# Altium schematic sheet top.SchDoc: radFET Calibration Stand Card
size A4
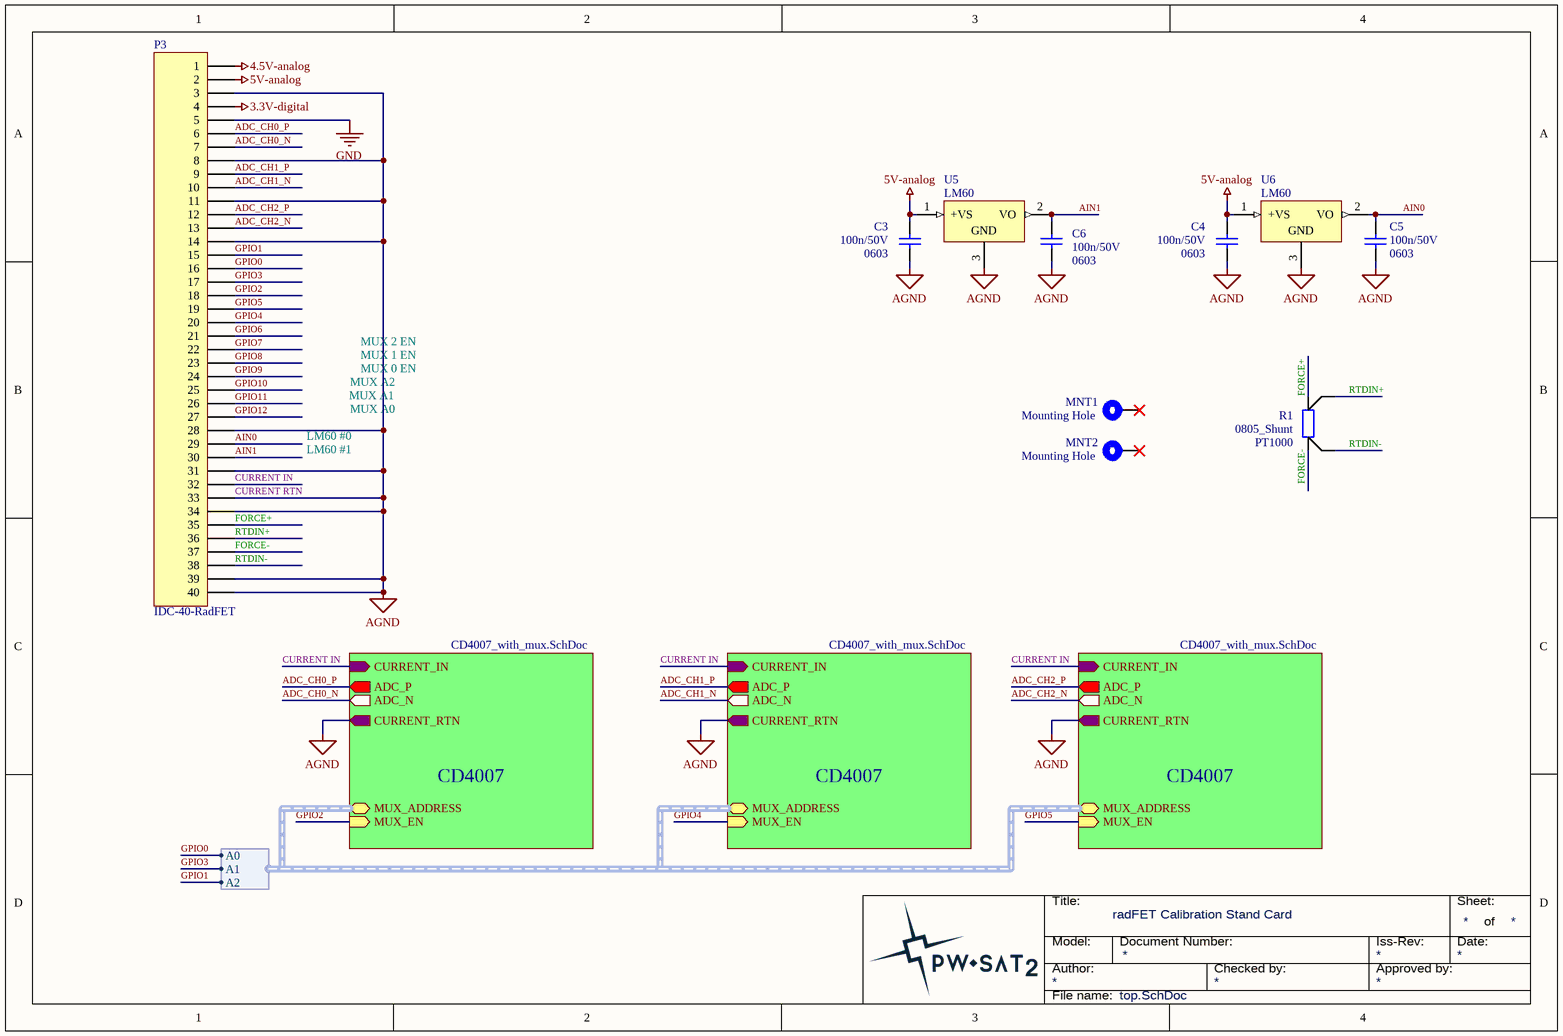
[diagram p0: top.SchDoc]

## Parts
C3  Package: 0603  [SMD_Capacitor_0603]  (hidden comment: 100n/50V)
C4  Package: 0603  [SMD_Capacitor_0603]  (hidden comment: 100n/50V)
C5  Package: 0603  [SMD_Capacitor_0603]  (hidden comment: 100n/50V)
C6  Package: 0603  [SMD_Capacitor_0603]  (hidden comment: 100n/50V)
MNT1  Mounting Hole  [PC-104_PcbMntHole_M3]
MNT2  Mounting Hole  [PC-104_PcbMntHole_M3]
P3  IDC-40-RadFET  [IDC-40-Male-Socket-Angle]
R1  Package: 0805_Shunt  [SMD_Resistor-shunt_0805]  (hidden comment: PT1000)
U5  LM60  [SOT23-3]
U6  LM60  [SOT23-3]

## Sub-sheets
CD4007 = CD4007_with_mux.SchDoc: CURRENT_IN (in), ADC_P (out), ADC_N (out), MUX_EN (in), MUX_ADDRESS (harness MUX_Address), CURRENT_RTN (out)
CD4007 = CD4007_with_mux.SchDoc: CURRENT_IN (in), ADC_P (out), ADC_N (out), MUX_EN (in), MUX_ADDRESS (harness MUX_Address), CURRENT_RTN (out)
CD4007 = CD4007_with_mux.SchDoc: CURRENT_IN (in), ADC_P (out), ADC_N (out), MUX_EN (in), MUX_ADDRESS (harness MUX_Address), CURRENT_RTN (out)

## Harnesses
MUX_Address: A0, A1, A2

## Nets
3.3V-digital: P3.4
4.5V-analog: P3.1
5V-analog: C3.1 C4.1 P3.2 U5.1(+VS) U6.1(+VS)
CURRENT RTN: C3.2 C4.2 C5.2 C6.2 P3.3 P3.8 P3.11 P3.14 P3.28 P3.31 P3.33 P3.34 P3.39 P3.40 U5.3(GND) U6.3(GND) ; sheet CD4007/CURRENT_RTN, sheet CD4007/CURRENT_RTN, sheet CD4007/CURRENT_RTN  [also labelled AGND]
GND: P3.5
ADC_CH0_N: P3.7 ; sheet CD4007/ADC_N
ADC_CH0_P: P3.6 ; sheet CD4007/ADC_P
ADC_CH1_N: P3.10 ; sheet CD4007/ADC_N
ADC_CH1_P: P3.9 ; sheet CD4007/ADC_P
ADC_CH2_N: P3.13 ; sheet CD4007/ADC_N
ADC_CH2_P: P3.12 ; sheet CD4007/ADC_P
AIN0: C5.1 P3.29 U6.2(VO)
AIN1: C6.1 P3.30 U5.2(VO)
CURRENT IN: P3.32 ; sheet CD4007/CURRENT_IN, sheet CD4007/CURRENT_IN, sheet CD4007/CURRENT_IN
FORCE+: P3.35 R1.4
FORCE-: P3.37 R1.1
GPIO0: P3.16 ; sheet CD4007/MUX_ADDRESS.A0
GPIO1: P3.15 ; sheet CD4007/MUX_ADDRESS.A2
GPIO2: P3.18 ; sheet CD4007/MUX_EN
GPIO3: P3.17 ; sheet CD4007/MUX_ADDRESS.A1
GPIO4: P3.20 ; sheet CD4007/MUX_EN
GPIO5: P3.19 ; sheet CD4007/MUX_EN
GPIO6: P3.21
GPIO7: P3.22
GPIO8: P3.23
GPIO9: P3.24
GPIO10: P3.25
GPIO11: P3.26
GPIO12: P3.27
RTDIN+: P3.36 R1.3
RTDIN-: P3.38 R1.2

Not connected (* = marked no-connect by the designer): MNT1 1*; MNT2 1*

## Notes on the sheet
- MUX A2
- MUX 2 EN
- MUX 1 EN
- MUX 0 EN
- LM60 #0
- MUX A1
- MUX A0
- LM60 #1
- Title:
- Sheet:
- of
- Author:
- Model:
- Document Number:
- Checked by:
- Iss-Rev:
- Approved by:
- Date:
- File name:

## Library data of the parts
C3-C6 = Cer_C0603T104K5RALTU: Ceramic Cap Kemet COTS 100n/50V X7R 0603; Manufacturer: Kemet; ManufacturerPartNumber: C0603T104K5RALTU; Value: 100n/50V
MNT1 MNT2 = MntHole: PCB Mounting Hole; Value: Mounting Hole
R1 = PT1000: Platinum Thin-Film Chip Sensor; Manufacturer: IST INNOVATIVE SENSOR TECHNOLOGY; ManufacturerPartNumber: P1K0.0805.2P.A; TCR: 3850ppm/K; Farnell: http://pl.farnell.com/ist-innovative-sensor-technology/p1k0-0805-2p-a/sensor-pt1000-smd0805-class-a/dp/1266951; Manufacturer's Datasheet: http://www.farnell.com/datasheets/57422.pdf; Value: PT1000
U5 U6 = LM60: Analog temperature sensor
P3 = IDC-40-RadFET: LatestRevisionDate: 17-Jul-2002; LatestRevisionNote: Re-released for DXP Platform.; Publisher: Altium Limited